# Altium schematic sheet FPGA_51_Countdown.SchDoc: LiveDesign Evaluation - Countdown
size A3; Organization: Altium Limited; Address1: L3, 12a Rodborough Rd; Address2: Frenchs Forest; Address3: NSW; Address4: Australia 2086; DocumentNumber: 1; SheetNumber: 1; SheetTotal: 4
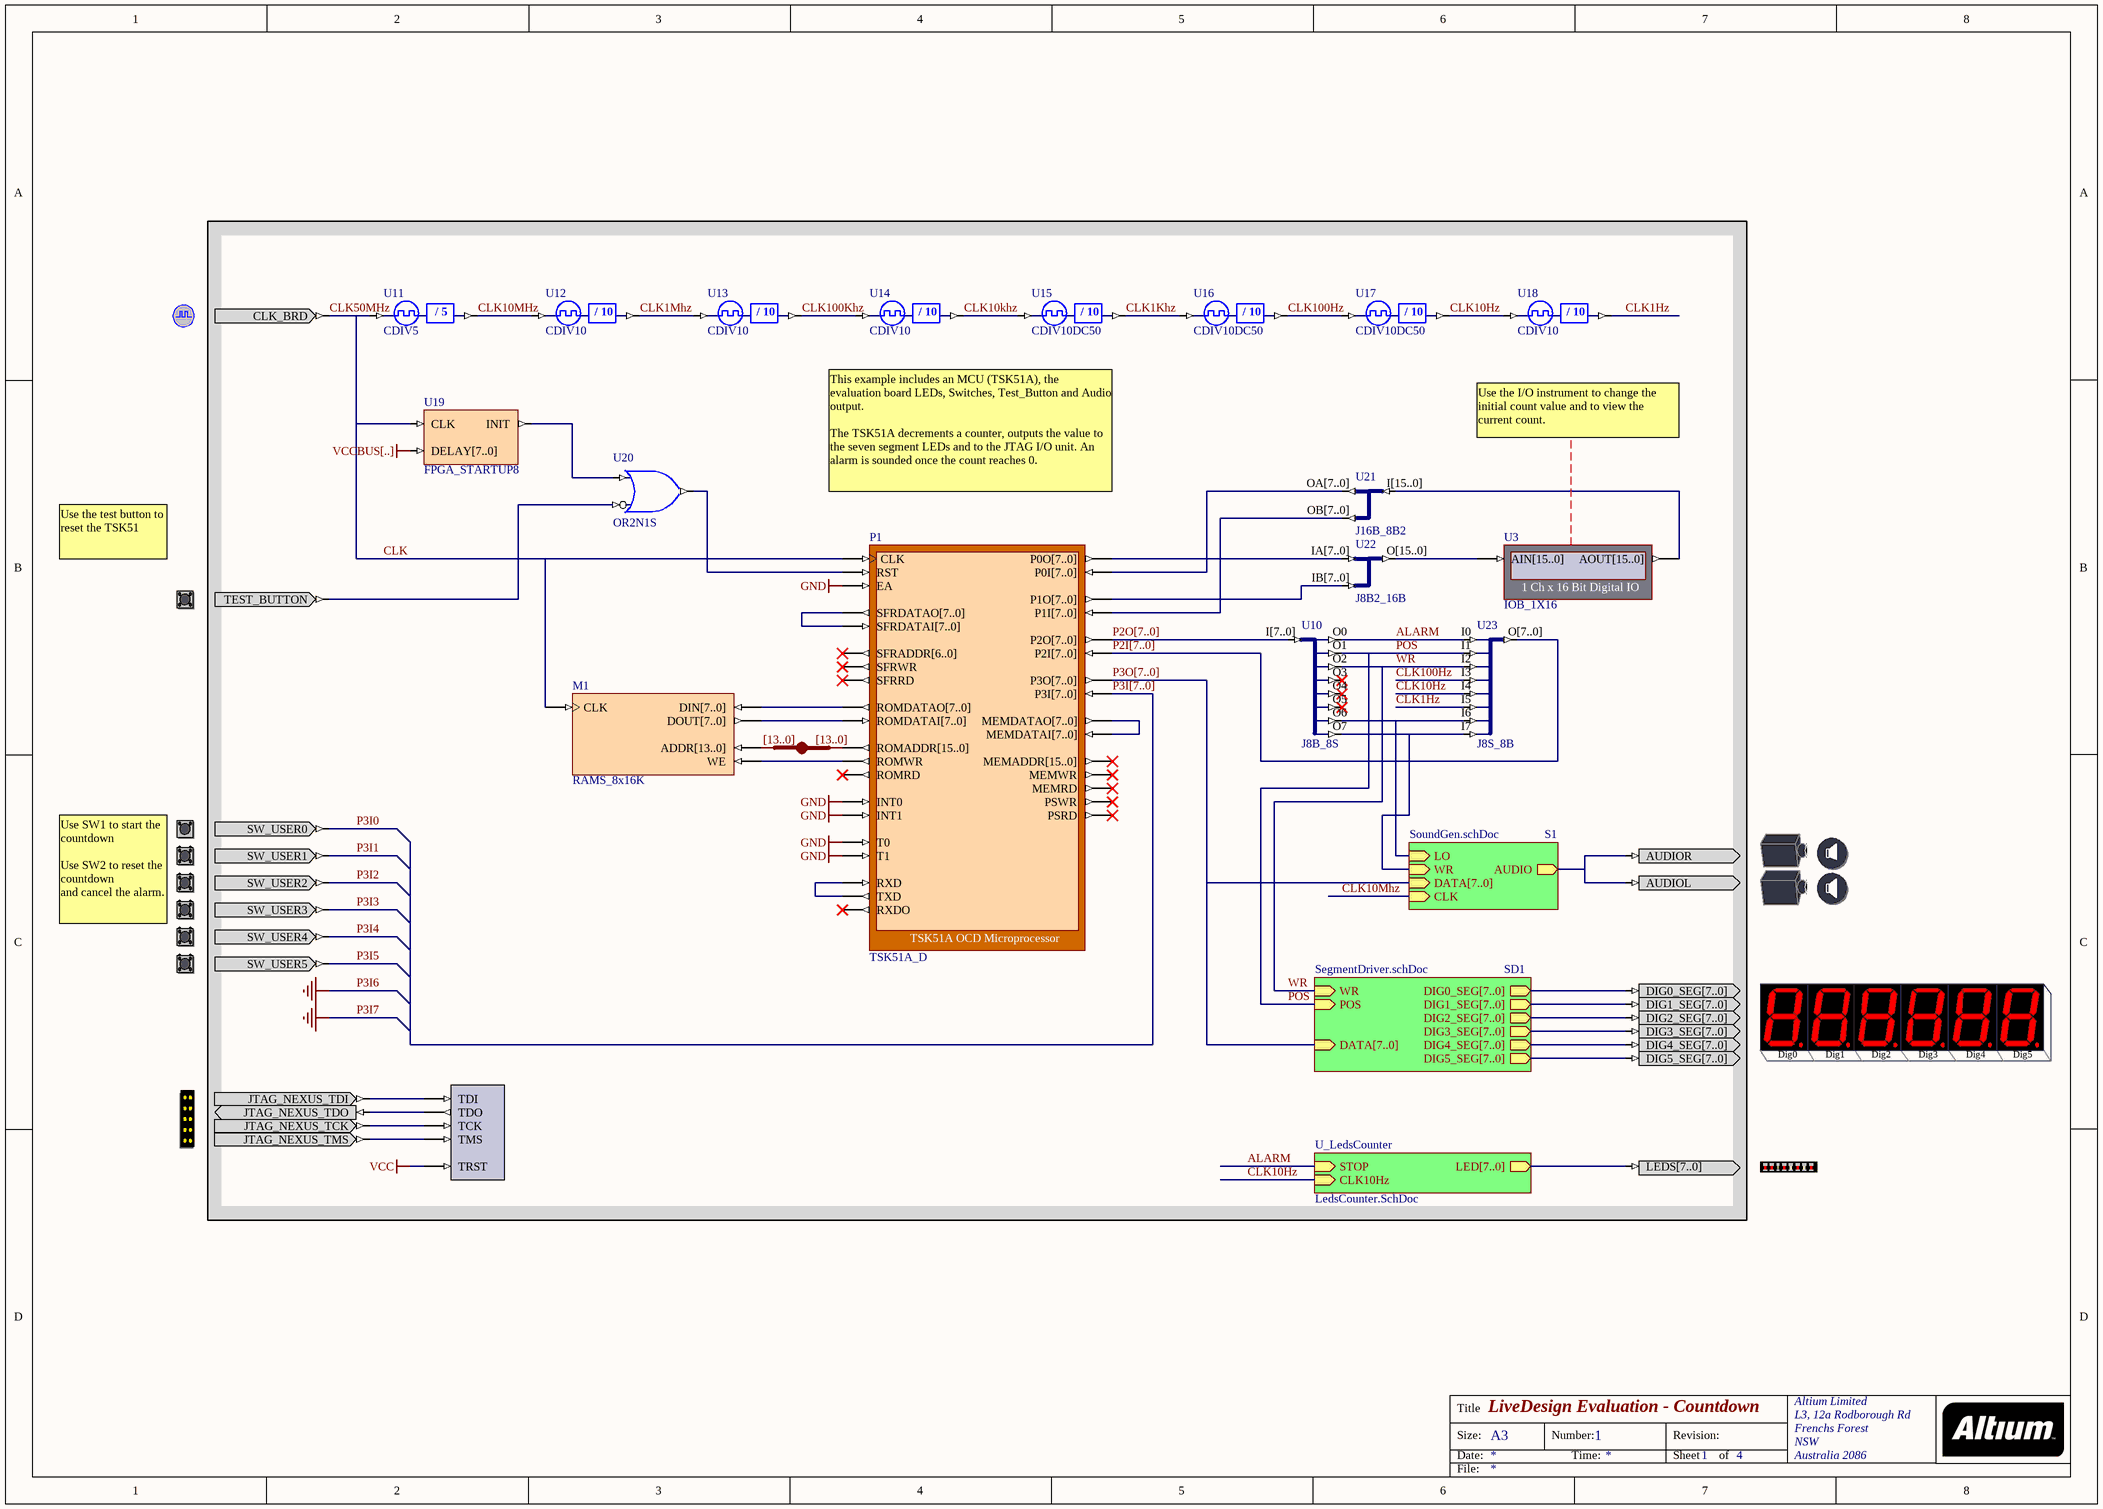
[diagram p0: FPGA_51_Countdown.SchDoc]

## Parts
(Parts that share a designator on the sheet are numbered #1, #2 ... from top to bottom, then left to right.)
M1  RAMS_8x16K
NEXUS_JTAG_PORT  NEXUS_JTAG_PORT  (value not drawn)
P1  TSK51A_D
U3  IOB_1X16
U10  J8B_8S
U11  CDIV5
U12  CDIV10
U13  CDIV10
U14  CDIV10
U15  CDIV10DC50
U16  CDIV10DC50
U17  CDIV10DC50
U18  CDIV10
U19  FPGA_STARTUP8
U20  OR2N1S
U21  J16B_8B2
U22  J8B2_16B
U23  J8S_8B
U?#1  CLOCK_BOARD  (value not drawn)
U?#2  TEST_BUTTON  (value not drawn)
U?#3  IndexA: [13..0]  (hidden comment: JB)
U?#4  USER_BUTTONS  (value not drawn)
U?#5  STEREO  (value not drawn)
U?#6  7SEGX6  (value not drawn)
U?#7  NEXUS_JTAG_CONNECTOR  (value not drawn)
U?#8  LED  (value not drawn)

## Sub-sheets
S1 = SoundGen.schDoc: LO (in), WR (in), DATA[7..0] (in), AUDIO (out), CLK (in)
SD1 = SegmentDriver.schDoc: DATA[7..0] (in), POS (in), WR (in), DIG0_SEG[7..0] (out), DIG1_SEG[7..0] (out), DIG2_SEG[7..0] (out), DIG3_SEG[7..0] (out), DIG4_SEG[7..0] (out), DIG5_SEG[7..0] (out)
U_LedsCounter = LedsCounter.SchDoc: STOP (in), CLK10Hz (in), LED[7..0] (out)

## Nets
P3I6: P1.EA P1.INT0 P1.INT1 P1.T0 P1.T1  [also labelled GND, P3I7]
VCC: NEXUS_JTAG_PORT.TRST
VCCBUS[..]: U19.DELAY[7..0]
ALARM: U10.O0 U23.I0 ; sheet U_LedsCounter/STOP
CLK: M1.CLK P1.CLK U11.CLKIN U19.CLK U?#1.CLK_BRD  [also labelled CLK50MHz]
CLK1Hz: U18.CLKDV U23.I5
CLK1Khz: U15.CLKDV U16.CLKIN
CLK1Mhz: U12.CLKDV U13.CLKIN
CLK10Hz: U17.CLKDV U18.CLKIN U23.I4 ; sheet U_LedsCounter/CLK10Hz
CLK10khz: U14.CLKDV U15.CLKIN
CLK10MHz: U11.CLKDV U12.CLKIN ; sheet S1/CLK
CLK100Hz: U16.CLKDV U17.CLKIN U23.I3
CLK100Khz: U13.CLKDV U14.CLKIN
P2I[7..0]: P1.P2I[7..0] U23.O[7..0]
P2O[7..0]: P1.P2O[7..0] U10.I[7..0]
P3I0: U?#4.SW_USER0
P3I1: U?#4.SW_USER1
P3I2: U?#4.SW_USER2
P3I3: U?#4.SW_USER3
P3I4: U?#4.SW_USER4
P3I5: U?#4.SW_USER5
P3I[7..0]: P1.P3I[7..0]
P3O[7..0]: P1.P3O[7..0] ; sheet SD1/DATA[7..0], sheet S1/DATA[7..0]
POS: U10.O1 U23.I1 ; sheet SD1/POS
WR: U10.O2 U23.I2 ; sheet SD1/WR
NetM1_ADDR[13..0]: M1.ADDR[13..0] U?#3.A[0..0]
NetM1_DIN[7..0]: M1.DIN[7..0] P1.ROMDATAO[7..0]
NetM1_DOUT[7..0]: M1.DOUT[7..0] P1.ROMDATAI[7..0]
NetM1_WE: M1.WE P1.ROMWR
NetNEXUS_JTAG_PORT_TCK: NEXUS_JTAG_PORT.TCK U?#7.JTAG_NEXUS_TCK
NetNEXUS_JTAG_PORT_TDI: NEXUS_JTAG_PORT.TDI U?#7.JTAG_NEXUS_TDI
NetNEXUS_JTAG_PORT_TDO: NEXUS_JTAG_PORT.TDO U?#7.JTAG_NEXUS_TDO
NetNEXUS_JTAG_PORT_TMS: NEXUS_JTAG_PORT.TMS U?#7.JTAG_NEXUS_TMS
NetP1_MEMDATAI[7..0]: P1.MEMDATAI[7..0] P1.MEMDATAO[7..0]
NetP1_P0I[7..0]: P1.P0I[7..0] U21.OA[7..0]
NetP1_P0O[7..0]: P1.P0O[7..0] U22.IA[7..0]
NetP1_P1I[7..0]: P1.P1I[7..0] U21.OB[7..0]
NetP1_P1O[7..0]: P1.P1O[7..0] U22.IB[7..0]
NetP1_ROMADDR[15..0]: P1.ROMADDR[15..0] U?#3.B[0..0]
NetP1_RST: P1.RST U20.O
NetP1_RXD: P1.RXD P1.TXD
NetP1_SFRDATAI[7..0]: P1.SFRDATAI[7..0] P1.SFRDATAO[7..0]
NetU3_AIN[15..0]: U3.AIN[15..0] U22.O[15..0]
NetU3_AOUT[15..0]: U3.AOUT[15..0] U21.I[15..0]
NetU10_O6: U10.O6 U23.I6 ; sheet S1/LO
NetU10_O7: U10.O7 U23.I7 ; sheet S1/WR
NetU19_INIT: U19.INIT U20.I1
NetU20_I0: U20.I0 U?#2.TEST_BUTTON
NetU?#5_AUDIOL: U?#5.AUDIOL U?#5.AUDIOR ; sheet S1/AUDIO
NetU?#6_DIG0_SEG[7..0]: U?#6.DIG0_SEG[7..0] ; sheet SD1/DIG0_SEG[7..0]
NetU?#6_DIG1_SEG[7..0]: U?#6.DIG1_SEG[7..0] ; sheet SD1/DIG1_SEG[7..0]
NetU?#6_DIG2_SEG[7..0]: U?#6.DIG2_SEG[7..0] ; sheet SD1/DIG2_SEG[7..0]
NetU?#6_DIG3_SEG[7..0]: U?#6.DIG3_SEG[7..0] ; sheet SD1/DIG3_SEG[7..0]
NetU?#6_DIG4_SEG[7..0]: U?#6.DIG4_SEG[7..0] ; sheet SD1/DIG4_SEG[7..0]
NetU?#6_DIG5_SEG[7..0]: U?#6.DIG5_SEG[7..0] ; sheet SD1/DIG5_SEG[7..0]
NetU?#8_LEDS[7..0]: U?#8.LEDS[7..0] ; sheet U_LedsCounter/LED[7..0]

Not connected (* = marked no-connect by the designer): P1 MEMADDR[15..0]* MEMRD* MEMWR* PSRD* PSWR* ROMRD* RXDO* SFRADDR[6..0]* SFRRD* SFRWR*; U10 O3* O4* O5*

## Buses and harness runs
bus P2I[7..0]
bus P2O[7..0]
bus P3I[7..0]
bus P3O[7..0] = sheet S1/DATA[7..0] = sheet SD1/DATA[7..0]

## Notes on the sheet
- Use the I/O instrument to change the initial count value and to view the current count.
- This example includes an MCU (TSK51A), the evaluation board LEDs, Switches, Test_Button and Audio output.
  The TSK51A decrements a counter, outputs the value to the seven segment LEDs and to the JTAG I/O unit. An alarm is sounded once the count reaches 0.
- Use the test button to reset the TSK51
- Use SW1 to start the countdown
  Use SW2 to reset the countdown
  and cancel the alarm.
- Title
- Size:
- Date:
- A3
- Number:
- Time:
- Revision:
- Sheet
- of
- File:
- (in symbol 7SEGX6) Dig0; Dig1; Dig2; Dig3; Dig4; Dig5
- (in symbol CDIV5) / 5
- (in symbol CDIV10) / 10
- (in symbol CDIV10DC50) / 10

## Library data of the parts
M1 = RAMS_8x16K: Single Port RAM; Memory_Depth: 16384; Memory_Type: RAM_SinglePortBlock; Memory_Width: 8; Memory_ClockEdge: Rising; Nexus_Core: Memory_Program; Memory_EnablePin: False; Published: 23/04/2004; Publisher: Altium Hobart Technology Center
NEXUS_JTAG_PORT = NEXUS_JTAG_PORT: Nexus Processor JTAG Chain Connector; NEXUS_JTAG_CONNECTOR: True; Published: 5-Sep-2003; Publisher: Altium Hobart Technology Centre
P1 = TSK51A_D: TSK51A OCD Microprocessor; NEXUS_CORE: Processor_OCDS; NEXUS_JTAG_DEVICE: True; NEXUS_JTAG_ORDER: 0; ChildModel1: RAM256x8_TSK51D; ChildCore1: M1; Memory_Configuration: Record[NEXUS_CORE]{}ComponentDesignator[iram]{}Memory_Depth[256]{}Memory_UsageType[ram]{}ProgramDownloadAddress[0x0]{}Memory_BusType[c51:idata_bus]{n}Record[NEXUS_CORE]{}ComponentDesignator[xram]{}Memory_Depth[64k]{}Memory_UsageType[ram]{}ProgramDownloadAddress[0x0]{}Memory_BusType[c51:xdata_bus]{n}Record[NEXUS_CORE]{}ComponentDesignator[xrom]{}Memory_Depth[64k]{}Memory_UsageType[rom]{}ProgramDownloadAddress[0x0]{}Memory_BusType[c51:code_bus]{n}; Published: 10/11/2003; Publisher: Altium Hobart Technology Centre; Core Revision: 1.00.00
U3 = IOB_1X16: 1 Ch x 16 Bit Digital IO; NEXUS_CORE: Instrument; NEXUS_JTAG_DEVICE: True; NEXUS_JTAG_ORDER: 0; Published: 30/09/2003; Publisher: Altium Hobart Technology Centre; Core Revision: 1.00.00
U10 = J8B_8S: 8-Bit input bus to 8 single pin outputs; FunctionalClass: Bus Joiner; PortSize: 8; ArchiveName: GENERIC; VHDLIB_SIM: GENERIC_LIB; Published: 29-Jan-2004; Publisher: Altium Limited; LastRevisionNo: 1.00.00; HelpURL: CR0118 FPGA Generic Library Guide.pdf#page=303
U11 = CDIV5: Clock Divider by 5; DivisorRate: 5; ArchiveName: GENERIC; VHDLIB_SIM: GENERIC_LIB; Published: 29-Jan-2004; Publisher: Altium Limited; LastRevisionNo: 1.00.00; HelpURL: CR0118 FPGA Generic Library Guide.pdf#page=141; FunctionalClass: Clock Divider
U12-U14 = CDIV10: Clock Divider by 10; DivisorRate: 10; ArchiveName: GENERIC; VHDLIB_SIM: GENERIC_LIB; Published: 29-Jan-2004; Publisher: Altium Limited; LastRevisionNo: 1.00.00; HelpURL: CR0118 FPGA Generic Library Guide.pdf#page=141; FunctionalClass: Clock Divider
U15 U17 U18 = CDIV10DC50: Clock Divider by 10 with 50% Duty Cycle Output; DivisorRate: 10; ArchiveName: GENERIC; VHDLIB_SIM: GENERIC_LIB; XilinxEquivalent: CLK_DIV10; DutyCycle: 50; Published: 29-Jan-2004; Publisher: Altium Limited; LastRevisionNo: 1.00.00; HelpURL: CR0118 FPGA Generic Library Guide.pdf#page=142; FunctionalClass: Clock Divider
U16 = CDIV10DC50: Clock Divider by 10 with 50% Duty Cycle Output; ArchiveName: GENERIC; VHDLIB_SIM: GENERIC_LIB; Xilinx Equivalent: CLK_DIV10; Published: 29-Jan-2004; Publisher: Altium Limited; Core Revision: 1.00.00
U19 = FPGA_STARTUP8: FPGA Startup With 8 Bit Delay; Published: 21/01/2004; Publisher: Altium Hobart Technology Centre; Core Revision: 1.00.00
U20 = OR2N1S: 2-Input OR Gate with Active Low A Input, Single Pin Version; Xilinx Equivalent: OR2B1; ArchiveName: GENERIC; Published: 18-Dec-2003; Publisher: Altium Limited; Core Revision: 1.00.00
U21 = J16B_8B2: 1 x 16-bit input bus to 2 x 8-Bit output bus; FunctionalClass: Bus Joiner; PortSize: 16; ArchiveName: GENERIC; VHDLIB_SIM: GENERIC_LIB; Published: 29-Jan-2004; Publisher: Altium Limited; LastRevisionNo: 1.00.00; HelpURL: CR0118 FPGA Generic Library Guide.pdf#page=297
U22 = J8B2_16B: 2 x 8-Bit input bus to 1 x 16-bit output bus; FunctionalClass: Bus Joiner; PortSize: 8; ArchiveName: GENERIC; VHDLIB_SIM: GENERIC_LIB; Published: 29-Jan-2004; Publisher: Altium Limited; LastRevisionNo: 1.00.00; HelpURL: CR0118 FPGA Generic Library Guide.pdf#page=301
U23 = J8S_8B: 8 Single pin inputs to single 8-Bit output bus; FunctionalClass: Bus Joiner; PortSize: 8; ArchiveName: GENERIC; VHDLIB_SIM: GENERIC_LIB; Published: 29-Jan-2004; Publisher: Altium Limited; LastRevisionNo: 1.00.00; HelpURL: CR0118 FPGA Generic Library Guide.pdf#page=305
U?#1 = CLOCK_BOARD: Global System Clock Supply; PortComponent: True; Published: 19-Nov-2003; Publisher: Altium Limited
U?#2 = TEST_BUTTON: Test Button; PortComponent: True; Published: 19-Nov-2003; Publisher: Altium Limited
U?#3 = JB: System BUS Joiner; Published: 29-Jan-2004; Publisher: Altium Limited; Core Revision: 1.00.00; HelpURL: CR0118 FPGA Generic Library Guide.pdf#page=296; Functional Class: Bus Joiner; IndexB: [13..0]
U?#4 = USER_BUTTONS: User Buttons; PortComponent: True; Published: 19-Nov-2003; Publisher: Altium Limited
U?#5 = STEREO: Sound interface; PortComponent: True; Published: 19-Nov-2003; Publisher: Altium Limited
U?#6 = 7SEGX6: 6 x 7 Segment display module; PortComponent: True; Publisher: Altium Limited; Published: 9-Sept-2004
U?#7 = NEXUS_JTAG_CONNECTOR: JTAG Port; PortComponent: True; Published: 19-Nov-2003; Publisher: Altium Limited
U?#8 = LED: 8-Way LEDS; PortComponent: True; Published: 19-Nov-2003; Publisher: Altium Limited